# EasyEDA Pro project F446 V1.1.epro, board PCB2
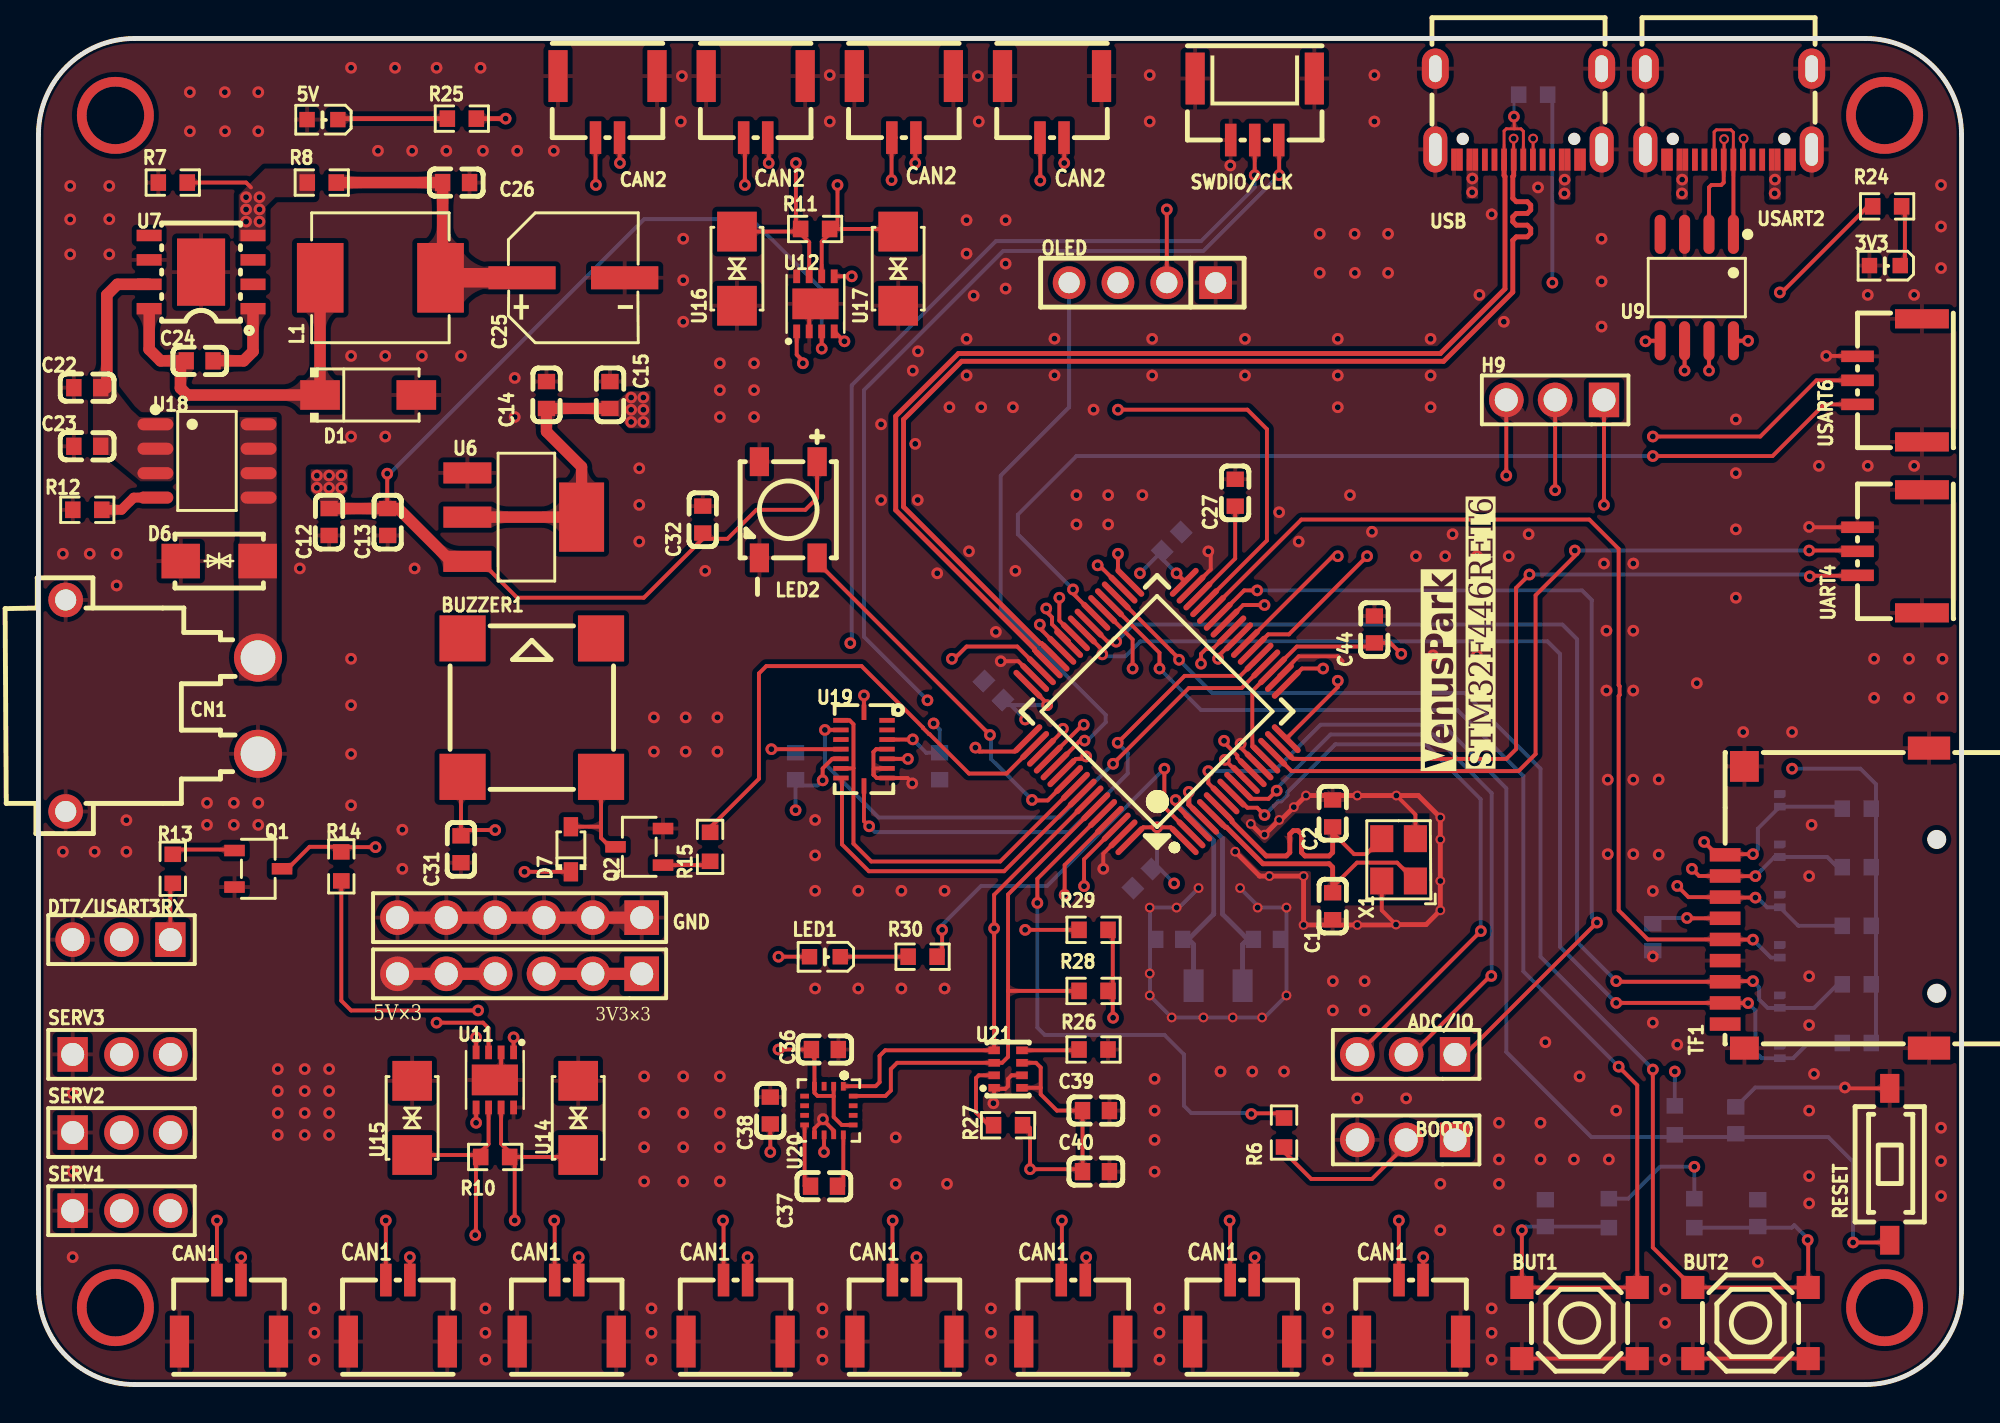
[diagram p1: board, top side]
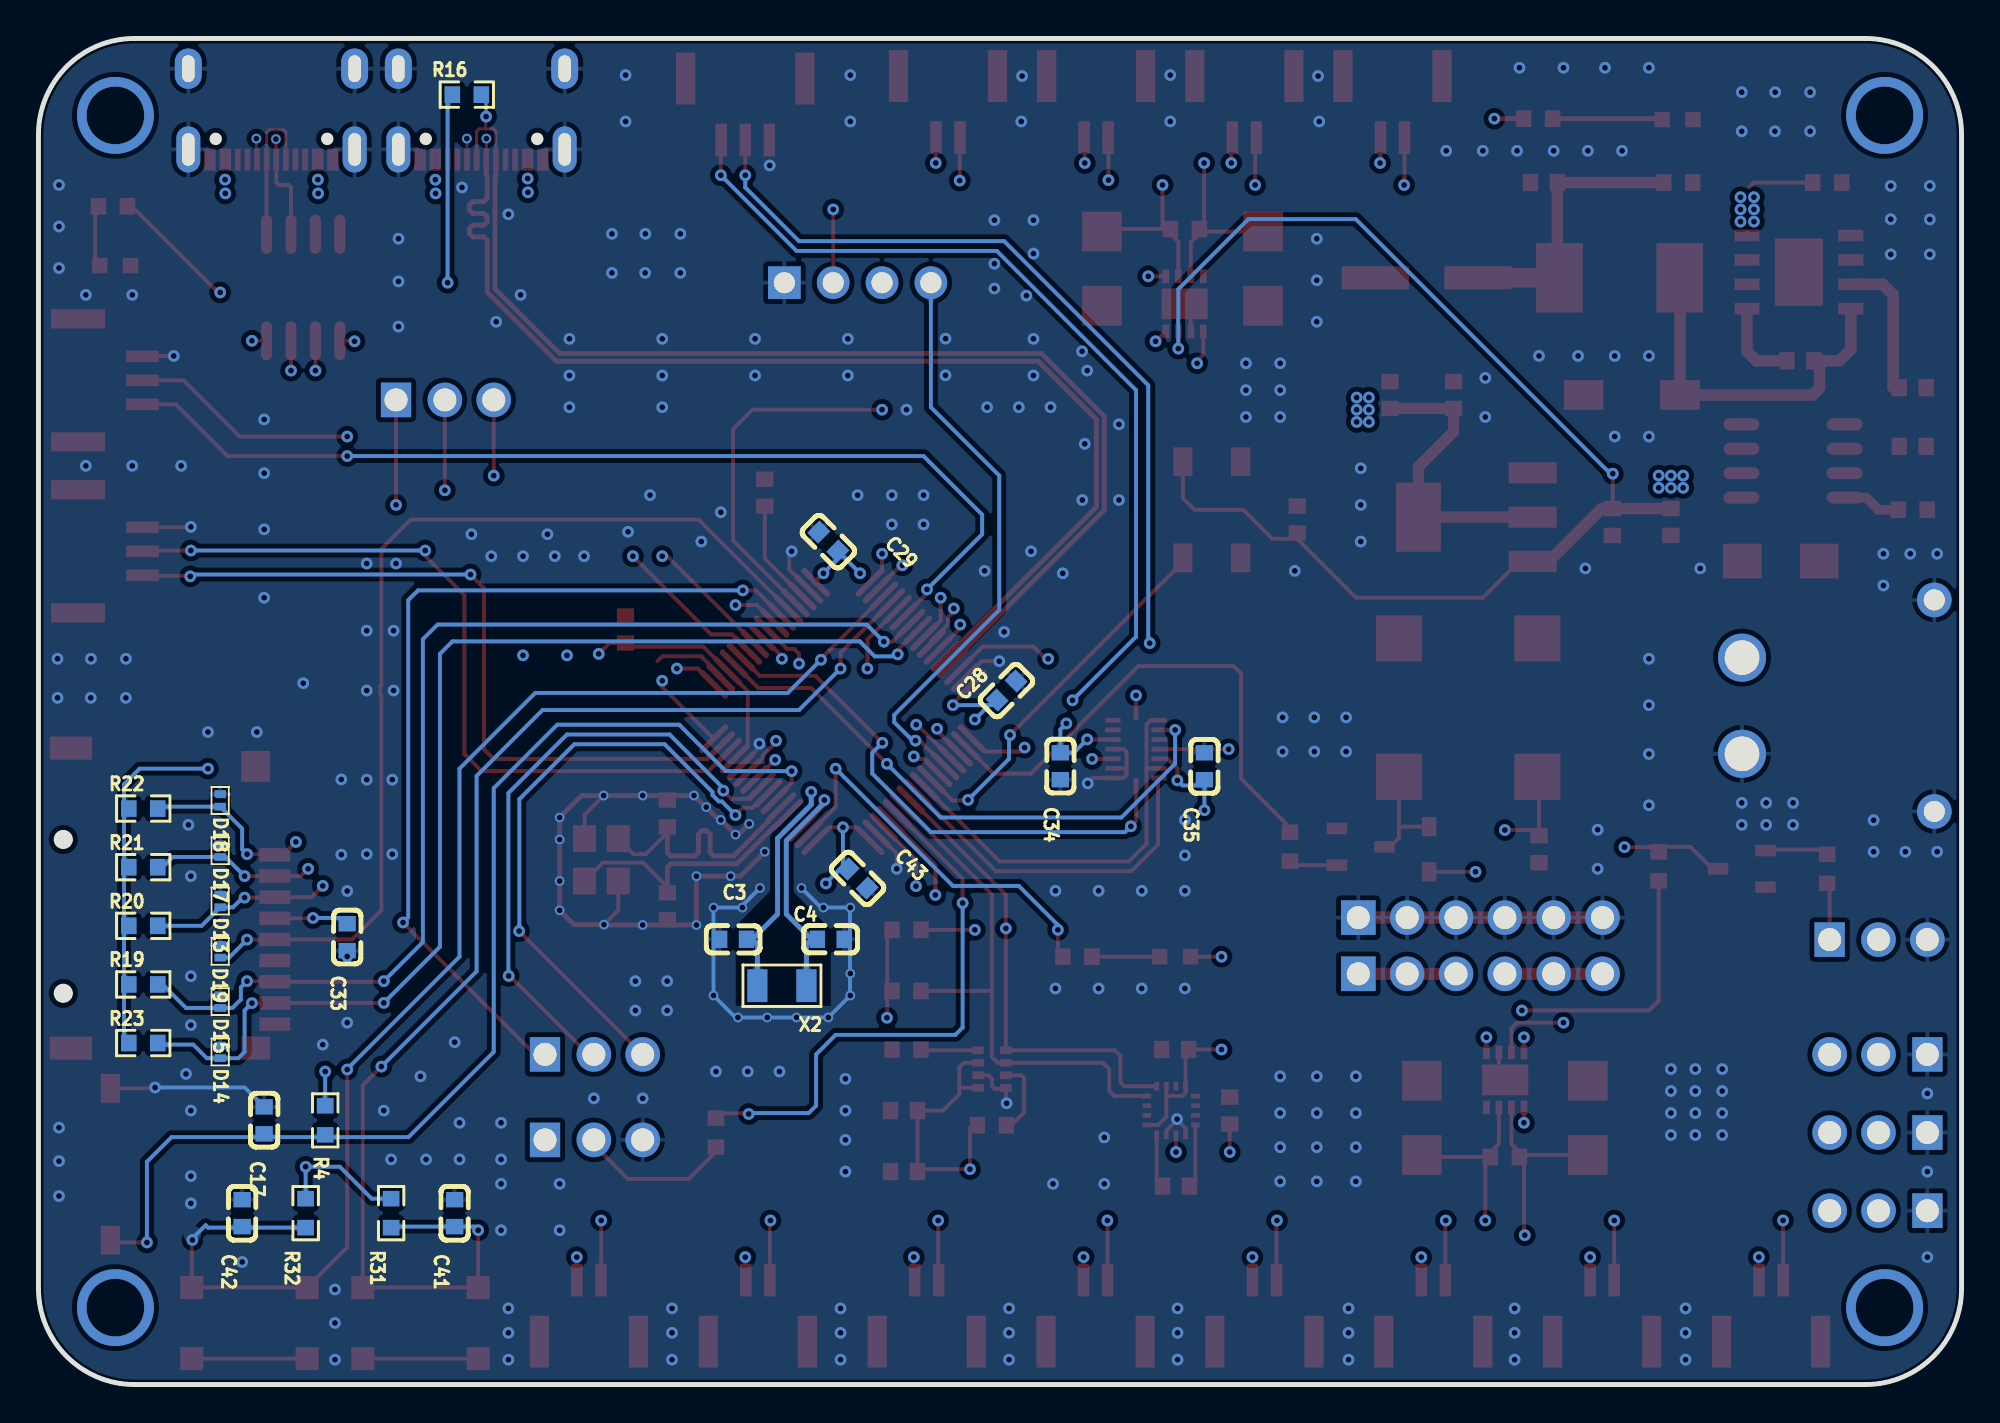
[diagram p2: board, bottom side, seen from below]

Outline 100 x 70 mm; copper layers: Top Layer, GND1, SIG, POW, GND2, Bottom Layer. Coordinates in mm from the lower left corner of the outline.
Outline path: 0,65 0,5 arc(1.46,1.46) 5,0 95,0 arc(98.54,1.46) 100,5 100,65 arc(98.54,68.54) 95,70 5,70 arc(1.46,68.54) 0,65
Stack: Top Layer 0.035mm 外层铜厚1oz / Dielectric1 0.2104mm 7628 RC49% 8.6mil / GND1 0.035mm 内层铜厚 / Dielectric2 0.4mm 0.4mm H/HOZ No copper / SIG 0.035mm 内层铜厚 / Dielectric3 0.2028mm 7628 RC49% 8.6mil / POW 0.035mm 内层铜厚 / Dielectric4 0.4mm 0.4mm H/HOZ No copper / GND2 0.035mm 内层铜厚 / Dielectric5 0.2104mm 7628 RC49% 8.6mil / Bottom Layer 0.035mm 外层铜厚1oz

## Design rules (mm)
net OSC_IN: osc
net OSC_OUT: osc
net OSC32OUT: osc32
net OSC32IN: osc32
net USB_DP: USB_FS
net USB_DM: USB_FS
net TTL_DP: USB_TTL
net TTL_DM: USB_TTL
template: 自定义配置
spacing copperThickness1oz (default): track to track 0.102, other pairs 0.152 to 0.3
spacing copperThickness2oz: track to track 0.203, other pairs 0.152 to 0.3
track width copperThickness1oz (default): min 0.127, default 0.203, max 2.54
track width copperThickness2oz: min 0.203, default 0.254, max 2.54
differential pair differentialPair (default): width min 0.127, default 0.254, max 2.54; gap min 0.152, default 0.152
via viaSize (default): diameter min 0.406, default 0.61, max 10; hole min 0.305, default 0.305, max 6.299

## Placement (name value [footprint] x y rotation side)
3V3  -  [LED0603-R-RD_WHITE]  96.01 58.19 180 top
3V3×3  -  [HDR-TH_6P-P2.54-V-M-1]  25.02 21.36 180 top
5V  -  [LED0603-R-RD_WHITE]  14.77 65.78 180 top
ADC/IO  -  [HDR-TH_3P-P2.54-V-M-1]  71.12 17.17 180 top
BOOT0
  -  [HDR-TH_3P-P2.54-V-M-1]  71.12 12.72 180 top
BUT1  -  [KEY-SMD_4P-L5.1-W5.1-P3.70-LS6.5]  80.14 3.2 0 top
BUT2  -  [KEY-SMD_4P-L5.1-W5.1-P3.70-LS6.5]  89.03 3.2 0 top
BUZZER1  2.7kHz  [BUZ-SMD_4P-L8.5-W8.5-P8.50-BR]  25.65 35.2 0 top
C1  20pF  [C0603]  67.3 24.87 270 top
C2  20pF  [C0603]  67.3 29.7 270 top
C3  20pF  [C0603]  63.88 23.15 0 bottom
C4  20pF  [C0603]  58.8 23.15 180 bottom
C12  10uF  [C0603]  15.11 44.85 90 top
C13  100nF  [C0603]  18.16 44.85 90 top
C14  10uF  [C0603]  26.42 51.46 270 top
C15  100nF  [C0603]  29.72 51.46 270 top
C17  1uF  [C0603]  88.26 13.74 270 bottom
C22  100nF  [C0603]  2.54 51.84 0 top
C23  10uF  [C0603]  2.54 48.79 0 top
C24  100nF  [C0603]  8.38 53.24 180 top
C25  220uF  [CAP-SMD_BD6.3-L6.6-W6.6-LS7.2-FD]  27.81 57.55 0 top
C26  100nF  [C0603]  21.72 62.51 180 top
C27  2.2uF  [C0603]  62.23 46.38 90 top
C28  100nF  [C0603]  49.66 36.09 135 bottom
C29  100nF  [C0603]  58.93 43.84 45 bottom
C31  100nF  [C0603]  21.97 27.84 90 top
C32  100nF  [C0603]  34.54 44.98 90 top
C33  100nF  [C0603]  83.95 23.26 270 bottom
C34  100nF  [C0603]  46.86 32.15 270 bottom
C35  100nF  [C0603]  39.37 32.15 90 bottom
C36  100nF  [C0603]  40.89 17.42 0 top
C37  220nF  [C0603]  40.85 10.31 0 top
C38  10uF  [C0603]  38.05 14.25 270 top
C39  100nF  [C0603]  54.99 14.25 0 top
C40  100nF  [C0603]  54.99 11.07 0 top
C41  1uF  [C0603]  78.36 8.91 90 bottom
C42  1uF  [C0603]  89.41 8.91 90 bottom
C43  100nF  [C0603]  57.4 26.31 225 bottom
C44  100nF  [C0603]  69.47 39.27 90 top
CAN1  -  [CONN-SMD_A1257WR-S-2P]  9.91 3.83 0 top
CAN2  -  [CONN-SMD_A1257WR-S-2P]  29.59 66.44 180 top
CN1  XT30PW-M  [CONN-TH_XT30PW-M]  6.42 35.3 270 top
CN7  A1257WR-S-2P  [CONN-SMD_A1257WR-S-2P]  18.69 3.83 0 top
CN8  A1257WR-S-2P  [CONN-SMD_A1257WR-S-2P]  27.47 3.83 0 top
CN9  A1257WR-S-2P  [CONN-SMD_A1257WR-S-2P]  36.25 3.83 0 top
CN10  A1257WR-S-2P  [CONN-SMD_A1257WR-S-2P]  45.03 3.83 0 top
CN11  A1257WR-S-2P  [CONN-SMD_A1257WR-S-2P]  53.81 3.83 0 top
CN12  A1257WR-S-2P  [CONN-SMD_A1257WR-S-2P]  62.59 3.83 0 top
CN13  A1257WR-S-2P  [CONN-SMD_A1257WR-S-2P]  71.37 3.83 0 top
CN15  A1257WR-S-2P  [CONN-SMD_A1257WR-S-2P]  37.3 66.44 180 top
CN16  A1257WR-S-2P  [CONN-SMD_A1257WR-S-2P]  45 66.44 180 top
CN17  A1257WR-S-2P  [CONN-SMD_A1257WR-S-2P]  52.71 66.44 180 top
D1  SS54  [SMA_L4.4-W2.8-LS5.4-R-RD]  17.14 51.46 0 top
D6  SMAJ28CA  [SMA_L4.3-W2.5-LS5.0-BI]  9.4 42.82 0 top
D7  IN4148WS  [SOD-323_L1.8-W1.3-LS2.5-RD]  27.69 27.84 90 top
D13  AZ5725-01F  [DFN-2L_L1.0-W0.6-P0.65-BI]  90.55 25.14 270 bottom
D14  AZ5725-01F  [DFN-2L_L1.0-W0.6-P0.65-BI]  90.55 17.3 270 bottom
D15  AZ5725-01F  [DFN-2L_L1.0-W0.6-P0.65-BI]  90.55 19.91 270 bottom
D17  AZ5725-01F  [DFN-2L_L1.0-W0.6-P0.65-BI]  90.55 27.76 270 bottom
D18  AZ5725-01F  [DFN-2L_L1.0-W0.6-P0.65-BI]  90.55 30.38 270 bottom
D19  AZ5725-01F  [DFN-2L_L1.0-W0.6-P0.65-BI]  90.55 22.53 270 bottom
DT7/USART3RX  -  [HDR-TH_3P-P2.54-V-M-1]  4.32 23.14 180 top
GND  -  [HDR-TH_6P-P2.54-V-M-1]  25.02 24.28 180 top
H9  2.54-1*3P针  [HDR-TH_3P-P2.54-V-M-1]  78.87 51.2 180 top
L1  15uH  [IND-SMD_L7.0-W6.6_FXL0630]  17.78 57.55 180 top
LED1  KT-0805G  [LED0603-R-RD_WHITE]  40.89 22.25 180 top
LED2  XL-5050RGBC-WS2812B  [LED-SMD_4P-L5.0-W5.0-BL_XL-5050RGBC]  38.99 45.49 180 top
OLED  -  [HDR-TH_4P-P2.54-V-F]  57.4 57.3 180 top
Q1  S8050  [SOT-23-3_L2.9-W1.6-P1.90-LS2.8-BR]  11.43 26.82 180 top
Q2  S8050  [SOT-23-3_L2.9-W1.6-P1.90-LS2.8-BR]  31.24 27.96 0 top
R4  10kΩ  [R0603]  85.09 13.74 90 bottom
R6  10kΩ  [R0603]  64.77 13.1 90 top
R7  100K  [R0603]  6.98 62.51 180 top
R8  10kΩ  [R0603]  14.73 62.51 180 top
R10  120Ω  [R0603]  23.75 11.83 0 top
R11  120Ω  [R0603]  40.39 60.09 180 top
R12  4.7kΩ  [R0603]  2.54 45.49 180 top
R13  4.7kΩ  [R0603]  6.98 26.82 90 top
R14  4.7kΩ  [R0603]  15.75 26.95 270 top
R15  1kΩ  [R0603]  34.93 27.96 270 top
R16  1.5kΩ  [R0603]  77.72 67.08 0 bottom
R19  10kΩ  [R0603]  94.55 20.81 180 bottom
R20  10kΩ  [R0603]  94.55 23.86 180 bottom
R21  10kΩ  [R0603]  94.55 26.9 180 bottom
R22  10kΩ  [R0603]  94.55 29.95 180 bottom
R23  10kΩ  [R0603]  94.55 17.76 180 bottom
R24  1kΩ  [R0603]  96.13 61.27 0 top
R25  4.7kΩ  [R0603]  22.02 65.83 180 top
R26  10kΩ  [R0603]  54.86 17.42 0 top
R27  10kΩ  [R0603]  50.42 13.48 180 top
R28  4.7kΩ  [R0603]  54.86 20.47 0 top
R29  4.7kΩ  [R0603]  54.86 23.64 0 top
R30  1kΩ  [R0603]  45.97 22.25 180 top
R31  10kΩ  [R0603]  81.66 8.91 90 bottom
R32  10kΩ  [R0603]  86.11 8.91 90 bottom
RESET  -  [SW-SMD_L6.0-W3.6-LS8.0]  96.27 11.45 90 top
SERV1  -  [HDR-TH_3P-P2.54-V-M-1]  4.32 9.04 0 top
SERV2  -  [HDR-TH_3P-P2.54-V-M-1]  4.32 13.1 0 top
SERV3  -  [HDR-TH_3P-P2.54-V-M-1]  4.32 17.17 0 top
STM32F446RET6  -  [LQFP-64_L10.0-W10.0-P0.50-LS12.0-BL]  58.17 35 45 top
SWDIO/CLK  -  [CONN-SMD_A1257WR-S-3P]  63.25 66.32 180 top
TF1  TF-012  [TF-SMD_TF-012]  93.01 25.3 90 top
U6  AMS1117-3.3  [SOT-223-3_L6.5-W3.4-P2.30-LS7.0-BR]  25.27 45.11 180 top
U7  TPS5430DDAR  [ESOP-8_L4.9-W3.9-P1.27-LS6.0-TL-EP]  8.46 57.85 180 top
U9  CH340N  [SOP-8_L5.0-W4.0-P1.27-LS6.0-BL]  86.23 57.05 180 top
U11  TJA1044GTK/3Z  [HVSON-8_L3.0-W3.0-P0.65-BL-EP]  23.73 15.84 180 top
U12  TJA1044GTK/3Z  [HVSON-8_L3.0-W3.0-P0.65-BL-EP]  40.4 56.2 0 top
U14  SMAJ10CA  [DO-214AC_L4.3-W2.7-LS5.0-BI]  28.07 13.87 270 top
U15  SMAJ10CA  [DO-214AC_L4.3-W2.7-LS5.0-BI]  19.43 13.87 270 top
U16  SMAJ10CA  [DO-214AC_L4.3-W2.7-LS5.0-BI]  36.32 58.03 90 top
U17  SMAJ10CA  [DO-214AC_L4.3-W2.7-LS5.0-BI]  44.7 58.03 90 top
U18  AO4441(UMW)  [SOP-8_L4.9-W3.9-P1.27-LS6.0-BL]  8.76 48.03 270 top
U19  BMI088  [LGA-16_L4.5-W3.0-P0.50-BL]  42.93 33.04 180 top
U20  QMC5883L  [LGA-16_L3.0-W3.0-P0.50-BL_SQ]  41.1 14.25 180 top
U21  BMP280  [LGA-8_L2.5-W2.0-P0.65_AMP6127]  50.42 16.41 180 top
UART4  -  [CONN-SMD_A1257WV-S-3P]  96.27 43.33 90 top
USART2  -  [USB-SMD_TYPE-C16PIN]  87.88 66.06 180 top
USART6  -  [CONN-SMD_A1257WV-S-3P]  96.27 52.22 90 top
USB  -  [USB-SMD_TYPE-C16PIN]  76.96 66.06 180 top
X1  12MHz  [OSC-SMD_4P-L3.2-W2.5-BL]  70.73 27.29 90 top
X2  32.768kHz  [OSC-SMD_L3.2-W1.5]  61.34 20.74 0 bottom

## Footprints (pads in the part's own frame, mm; a bottom-side part is the same pattern mirrored in y, then rotated)
BUZ-SMD_4P-L8.5-W8.5-P8.50-BR
  rect 2.4x2.4 smd: 1(-3.6,-3.6) 2(3.6,-3.6) 3(3.599,3.599) 4(-3.6,3.6)
C0603
  rect 0.8x0.9 smd: 1(-0.7,0) 2(0.7,0)
CAP-SMD_BD6.3-L6.6-W6.6-LS7.2-FD
  rect 3.5x1.2 smd: 1(-2.67,0) 2(2.67,0)
CONN-SMD_A1257WR-S-2P
  rect 0.6x1.7 smd: 1(0.625,1.6) 2(-0.625,1.6)
  rect 1x2.7 smd: 3(2.575,-1.6) 4(-2.575,-1.6)
CONN-SMD_A1257WR-S-3P
  rect 0.6x1.7 smd: 1(1.25,1.6) 2(0,1.6) 3(-1.25,1.6)
  rect 1x2.7 smd: 4(3.1,-1.6) 5(-3.1,-1.6)
CONN-SMD_A1257WV-S-3P
  rect 0.6x1.7 smd: 1(1.25,1.675) 2(0,1.675) 3(-1.25,1.675)
  rect 1x2.8 smd: 4(3.2,-1.675) 5(-3.2,-1.675)
CONN-TH_XT30PW-M
  round 2.5 hole 1.8: 1(-2.5,5) 2(2.5,5)
  round 1.8 hole 1.1: 3(5.5,-5) 4(-5.5,-5)
DFN-2L_L1.0-W0.6-P0.65-BI
  custom 0x0 smd: 1(-0.325,0)
  rect 0.4x0.6 smd: 2(0.325,0)
DO-214AC_L4.3-W2.7-LS5.0-BI
  rect 2.07x2.06 smd: 1(-1.929,0) 2(1.929,0)
ESOP-8_L4.9-W3.9-P1.27-LS6.0-TL-EP
  rect 1.3x0.6 smd: 1(-2.7,1.905) 2(-2.7,0.635) 3(-2.7,-0.635) 4(-2.7,-1.905) 5(2.7,-1.905) 6(2.7,-0.635) 7(2.7,0.635) 8(2.7,1.905)
  rect 2.5x3.5 smd: 9(0,0)
HDR-TH_3P-P2.54-V-M-1
  rect 1.575x1.8 hole 1.2: 1(-2.54,0)
  round 1.8 hole 1.2: 2(0,0) 3(2.54,0)
HDR-TH_4P-P2.54-V-F
  rect 1.7x1.7 hole 1.1: 1(-3.81,0)
  round 1.7 hole 1.1: 2(-1.27,0) 3(1.27,0) 4(3.81,0)
HDR-TH_6P-P2.54-V-M-1
  rect 1.8x1.8 hole 1.2: 1(-6.35,0)
  round 1.8 hole 1.2: 2(-3.81,0) 3(-1.27,0) 4(1.27,0) 5(3.81,0) 6(6.35,0)
HVSON-8_L3.0-W3.0-P0.65-BL-EP
  rect 0.355x0.711 smd: 1(-0.975,-1.433) 2(-0.325,-1.433) 3(0.325,-1.433) 4(0.975,-1.433) 5(0.975,1.433) 6(0.325,1.433) 7(-0.325,1.433) 8(-0.975,1.433)
  rect 2.4x1.6 smd: 9(0,0)
IND-SMD_L7.0-W6.6_FXL0630
  rect 2.424x3.62 smd: 1(3.128,0) 2(-3.128,0)
KEY-SMD_4P-L5.1-W5.1-P3.70-LS6.5
  rect 1.2x1.2 smd: 1(-3,1.85) 2(3,1.85) 3(-3,-1.85) 4(3,-1.85)
LED0603-R-RD_WHITE
  rect 0.8x0.8 smd: 1(0.8,0) 2(-0.8,0)
LED-SMD_4P-L5.0-W5.0-BL_XL-5050RGBC
  rect 1x1.5 smd: 1(-1.5,-2.5) 2(1.5,-2.5) 3(1.5,2.5) 4(-1.5,2.5)
LGA-8_L2.5-W2.0-P0.65_AMP6127
  rect 0.6x0.4 smd: 1(0.725,0.975) 2(0.725,0.325) 3(0.725,-0.325) 4(0.725,-0.975) 5(-0.725,-0.975) 6(-0.725,-0.325) 7(-0.725,0.325) 8(-0.725,0.975)
LGA-16_L3.0-W3.0-P0.50-BL_SQ
  rect 0.25x0.45 smd: 1(-0.75,-1.263) 2(-0.25,-1.263) 3(0.25,-1.263) 4(0.75,-1.263) 9(0.75,1.263) 10(0.25,1.263) 11(-0.25,1.263) 12(-0.75,1.263)
  rect 0.45x0.25 smd: 5(1.263,-0.75) 6(1.263,-0.25) 7(1.263,0.25) 8(1.263,0.75) 13(-1.263,0.75) 14(-1.263,0.25) 15(-1.263,-0.25) 16(-1.263,-0.75)
LGA-16_L4.5-W3.0-P0.50-BL
  rect 0.8x0.25 smd: 1(-1.2,-1.498) 2(-1.2,-0.998) 3(-1.2,-0.498) 4(-1.2,0.002) 5(-1.2,0.502) 6(-1.2,1.002) 7(-1.2,1.502) 9(1.2,1.502) 10(1.2,1.002) 11(1.2,0.502) 12(1.2,0.002) 13(1.2,-0.498) 14(1.2,-0.998) 15(1.2,-1.498)
  rect 0.25x0.8 smd: 8(0,1.915) 16(0,-1.915)
LQFP-64_L10.0-W10.0-P0.50-LS12.0-BL
  oval 0.3x2 smd: 1(-3.75,-5.75) 2(-3.25,-5.75) 3(-2.75,-5.75) 4(-2.25,-5.75) 5(-1.75,-5.75) 6(-1.25,-5.75) 7(-0.75,-5.75) 8(-0.25,-5.75) 9(0.25,-5.75) 10(0.75,-5.75) 11(1.25,-5.75) 12(1.75,-5.75) 13(2.25,-5.75) 14(2.75,-5.75) 15(3.25,-5.75) 16(3.75,-5.75) 33(3.75,5.75) 34(3.25,5.75) 35(2.75,5.75) 36(2.25,5.75) 37(1.75,5.75) 38(1.25,5.75) 39(0.75,5.75) 40(0.25,5.75) 41(-0.25,5.75) 42(-0.75,5.75) 43(-1.25,5.75) 44(-1.75,5.75) 45(-2.25,5.75) 46(-2.75,5.75) 47(-3.25,5.75) 48(-3.75,5.75)
  oval 2x0.3 smd: 17(5.75,-3.75) 18(5.75,-3.25) 19(5.75,-2.75) 20(5.75,-2.25) 21(5.75,-1.75) 22(5.75,-1.25) 23(5.75,-0.75) 24(5.75,-0.25) 25(5.75,0.25) 26(5.75,0.75) 27(5.75,1.25) 28(5.75,1.75) 29(5.75,2.25) 30(5.75,2.75) 31(5.75,3.25) 32(5.75,3.75) 49(-5.75,3.75) 50(-5.75,3.25) 51(-5.75,2.75) 52(-5.75,2.25) 53(-5.75,1.75) 54(-5.75,1.25) 55(-5.75,0.75) 56(-5.75,0.25) 57(-5.75,-0.25) 58(-5.75,-0.75) 59(-5.75,-1.25) 60(-5.75,-1.75) 61(-5.75,-2.25) 62(-5.75,-2.75) 63(-5.75,-3.25) 64(-5.75,-3.75)
OSC-SMD_4P-L3.2-W2.5-BL
  rect 1.4x1.2 smd: 1(-1.1,-0.875) 2(1.1,-0.875) 3(1.1,0.875) 4(-1.1,0.875)
OSC-SMD_L3.2-W1.5
  rect 1.05x1.7 smd: 1(-1.275,0) 2(1.275,0)
R0603
  rect 0.806x0.864 smd: 1(-0.753,0) 2(0.753,0)
SMA_L4.3-W2.5-LS5.0-BI
  rect 2x1.8 smd: 1(-2,0) 2(2,0)
SMA_L4.4-W2.8-LS5.4-R-RD
  rect 2.062x1.539 smd: 1(2.503,0) 2(-2.503,0)
SOD-323_L1.8-W1.3-LS2.5-RD
  rect 1x0.75 smd: 1(-1.173,0) 2(1.173,0)
SOP-8_L4.9-W3.9-P1.27-LS6.0-BL
  oval 0.63x1.865 smd: 1(-1.905,-2.683) 2(-0.635,-2.683) 3(0.635,-2.683) 4(1.905,-2.683) 5(1.905,2.683) 6(0.635,2.683) 7(-0.635,2.683) 8(-1.905,2.683)
SOP-8_L5.0-W4.0-P1.27-LS6.0-BL
  oval 0.574x2.035 smd: 1(-1.905,-2.768) 2(-0.635,-2.768) 3(0.635,-2.768) 4(1.905,-2.768) 5(1.905,2.768) 6(0.635,2.768) 7(-0.635,2.768) 8(-1.905,2.768)
SOT-23-3_L2.9-W1.6-P1.90-LS2.8-BR
  rect 1.07x0.6 smd: 1(1.235,-0.95) 2(1.235,0.95) 3(-1.235,0)
SOT-223-3_L6.5-W3.4-P2.30-LS7.0-BR
  rect 2.5x1.1 smd: 1(2.97,-2.3) 2(2.97,0) 3(2.97,2.3)
  rect 2.34x3.6 smd: 4(-2.97,0)
SW-SMD_L6.0-W3.6-LS8.0
  rect 1.5x1 smd: 1(-3.95,0) 2(3.95,0)
TF-SMD_TF-012
  rect 0.7x1.6 smd: 1(2.25,5.3) 2(1.15,5.3) 3(0.05,5.3) 4(-1.05,5.3) 5(-2.15,5.3) 6(-3.25,5.3) 7(-4.35,5.3) 8(-5.45,5.3) CD(-6.55,5.3)
  rect 1.2x1.5 smd: 10(-7.8,4.3)
  rect 1.2x2.2 smd: 11(-7.8,-5.3) 12(7.8,-5.3)
  rect 1.6x1.5 smd: 13(6.85,4.3)
USB-SMD_TYPE-C16PIN
  oval 1.25x2.4 hole 0.65x1.7: 17(-4.325,1.835) 18(4.325,1.835)
  oval 1.4x2.1 hole 0.65x1.4: 19(-4.325,-2.365) 20(4.325,-2.365)
  rect 0.3x1.15 smd: A1(-3.35,2.365) A4(-2.55,2.365) A5(-1.25,2.365) A6(-0.25,2.365) A7(0.25,2.365) A8(1.25,2.365) A9(2.55,2.365) A12(3.35,2.365) B1(3.05,2.365) B4(2.25,2.365) B5(1.75,2.365) B6(0.75,2.365) B7(-0.75,2.365) B8(-1.75,2.365) B9(-2.25,2.365) B12(-3.05,2.365)

## Nets
+5V: 3V3×3.4 3V3×3.5 3V3×3.6 C12.2 C13.2 C32.1 DT7/USART3RX.2 LED2.1 OLED.2 R7.1 R8.2 R25.1 SERV1.2 SERV2.2 SERV3.2 U6.3 U7.4 U11.3 U12.3 USART2.A4 USART2.A9 USART2.B4 USART2.B9 USB.A4 USB.A9 USB.B4 USB.B9
GND: 3V3.1 5V.1 BOOT0
.3 BUT1.3 BUT1.4 BUT2.3 BUT2.4 C1.2 C2.1 C3.2 C4.2 C12.1 C13.1 C14.1 C15.1 C17.1 C22.1 C23.1 C25.2 C26.1 C27.2 C28.2 C29.2 C31.1 C32.2 C33.2 C34.2 C35.2 C36.2 C38.1 C39.2 C40.2 C41.2 C42.2 C43.2 C44.2 CAN1.3 CAN1.4 CAN2.3 CAN2.4 CN1.2 CN1.3 CN1.4 CN7.3 CN7.4 CN8.3 CN8.4 CN9.3 CN9.4 CN10.3 CN10.4 CN11.3 CN11.4 CN12.3 CN12.4 CN13.3 CN13.4 CN15.3 CN15.4 CN16.3 CN16.4 CN17.3 CN17.4 D1.1 D6.1 D13.1 D14.1 D15.1 D17.1 D18.1 D19.1 DT7/USART3RX.3 GND.1 GND.2 GND.3 GND.4 GND.5 GND.6 LED2.2 LED2.3 OLED.1 Q1.2 Q2.2 R7.2 R12.2 R26.2 RESET.2 SERV1.1 SERV2.1 SERV3.1 STM32F446RET6.12 STM32F446RET6.18 STM32F446RET6.31 STM32F446RET6.47 STM32F446RET6.63 SWDIO/CLK.1 SWDIO/CLK.4 SWDIO/CLK.5 TF1.6 TF1.10 TF1.11 TF1.12 TF1.13 U6.1 U7.6 U7.9 U9.3 U11.2 U11.8 U11.9 U12.2 U12.8 U12.9 U14.1 U15.1 U16.1 U17.1 U19.4 U19.6 U19.7 U20.9 U20.11 U21.1 U21.7 UART4.1 UART4.4 UART4.5 USART2.17 USART2.18 USART2.19 USART2.20 USART2.A1 USART2.A12 USART2.B1 USART2.B12 USART6.1 USART6.4 USART6.5 USB.17 USB.18 USB.19 USB.20 USB.A1 USB.A12 USB.B1 USB.B12 X1.2 X1.4
VCC3V3: 3V3×3.1 3V3×3.2 3V3×3.3 BOOT0
.1 BUZZER1.1 C14.2 C15.2 C28.1 C29.1 C31.2 C33.1 C34.1 C35.1 C36.1 C39.1 C40.1 C43.1 C44.1 D7.1 LED1.1 R4.2 R14.2 R16.2 R19.1 R20.1 R21.1 R22.1 R23.1 R24.1 R27.1 R28.2 R29.2 R31.2 R32.2 STM32F446RET6.1 STM32F446RET6.13 STM32F446RET6.19 STM32F446RET6.32 STM32F446RET6.48 STM32F446RET6.64 TF1.4 U6.2 U6.4 U9.5 U9.8 U11.5 U12.5 U19.3 U19.11 U20.2 U20.4 U20.13 U21.6 U21.8
VCC24V: C22.2 C23.2 U7.7 U18.1 U18.2 U18.3
ACCEL_CS: STM32F446RET6.20 U19.14
ACCEL_INT: STM32F446RET6.11 U19.16
ADC_IN1: ADC/IO.1 STM32F446RET6.27
ADC_IN2: ADC/IO.2 STM32F446RET6.9
ADC_IN3: ADC/IO.3 STM32F446RET6.8
BMI088_MISO: STM32F446RET6.56 U19.10 U19.15
BMI088_MOSI: STM32F446RET6.57 U19.9
BMI088_SCK: STM32F446RET6.21 U19.8
BOOT0: R6.2 STM32F446RET6.60
BUTTON1: BUT1.1 BUT1.2 C41.1 R31.1 STM32F446RET6.36
BUTTON2: BUT2.1 BUT2.2 C42.1 R32.1 STM32F446RET6.35
BUZZER: R15.1 STM32F446RET6.50
CAN1_H: CAN1.2 CN7.2 CN8.2 CN9.2 CN10.2 CN11.2 CN12.2 CN13.2 R10.2 U11.7 U14.2
CAN1_L: CAN1.1 CN7.1 CN8.1 CN9.1 CN10.1 CN11.1 CN12.1 CN13.1 R10.1 U11.6 U15.2
CAN1_RX: STM32F446RET6.61 U11.4
CAN1_TX: STM32F446RET6.62 U11.1
CAN2_H: CAN2.2 CN15.2 CN16.2 CN17.2 R11.2 U12.7 U16.2
CAN2_L: CAN2.1 CN15.1 CN16.1 CN17.1 R11.1 U12.6 U17.2
CAN2_RX: STM32F446RET6.33 U12.4
CAN2_TX: STM32F446RET6.34 U12.1
GYRO_CS: STM32F446RET6.24 U19.5
GYRO_INT: STM32F446RET6.10 U19.12
IMU_SCL: R29.1 STM32F446RET6.58 U20.1 U21.4
IMU_SDA: R28.1 STM32F446RET6.59 U20.16 U21.3
LED1: R30.1 STM32F446RET6.2
NRST: C17.2 R4.1 RESET.1 STM32F446RET6.7
OLED_SCL: OLED.3 STM32F446RET6.29
OLED_SDA: OLED.4 STM32F446RET6.53
OSC32IN: C4.1 STM32F446RET6.3 X2.1
OSC32OUT: C3.1 STM32F446RET6.4 X2.2
OSC_IN: C1.1 STM32F446RET6.5 X1.1
OSC_OUT: C2.2 STM32F446RET6.6 X1.3
POWER: CN1.1 D6.2 U18.5 U18.6 U18.7 U18.8
SDIO_CK: D19.2 STM32F446RET6.28 TF1.5
SDIO_CMD: D13.2 R20.2 STM32F446RET6.54 TF1.3
SDIO_D0: D15.2 R19.2 STM32F446RET6.39 TF1.7
SDIO_D1: D14.2 R23.2 STM32F446RET6.40 TF1.8
SDIO_D2: D18.2 R22.2 STM32F446RET6.51 TF1.1
SDIO_D3: D17.2 R21.2 STM32F446RET6.52 TF1.2
SERVO1: SERV1.3 STM32F446RET6.43
SERVO2: SERV2.3 STM32F446RET6.42
SERVO3: SERV3.3 STM32F446RET6.41
SWCLK: STM32F446RET6.49 SWDIO/CLK.3
SWDIO: STM32F446RET6.46 SWDIO/CLK.2
TIM3_CH1: H9.1 STM32F446RET6.22
TIM3_CH2: H9.2 STM32F446RET6.23
TIM3_CH3: H9.3 STM32F446RET6.26
TTL_DM: U9.2 USART2.A7 USART2.B7
TTL_DP: U9.1 USART2.A6 USART2.B6
UART4_RX: STM32F446RET6.15 UART4.3
UART4_TX: STM32F446RET6.14 UART4.2
USART2_RX: STM32F446RET6.17 U9.6
USART2_TX: STM32F446RET6.16 U9.7
USART3_RX: Q1.3 R14.1 STM32F446RET6.25
USART6_RX: STM32F446RET6.38 USART6.3
USART6_TX: STM32F446RET6.37 USART6.2
USB_DM: STM32F446RET6.44 USB.A7 USB.B7
USB_DP: R16.1 STM32F446RET6.45 USB.A6 USB.B6
WS2812: LED2.4 STM32F446RET6.55
$1N6813: BOOT0
.2 R6.1
$1N10170: C24.1 U7.1
$1N10572: C24.2 D1.2 L1.1 U7.8
$1N10581: C25.1 C26.2 L1.2 R8.1
$1N11994: C27.1 STM32F446RET6.30
$1N17339: R12.1 U18.4
$1N17600: DT7/USART3RX.1 R13.1
$1N17601: Q1.1 R13.2
$1N17854: BUZZER1.2 D7.2 Q2.3
$1N17986: Q2.1 R15.2
$1N19919: 3V3.2 R24.2
$1N19978: 5V.2 R25.2
$1N20666: C37.2 U20.12
$1N20667: C37.1 U20.8
$1N20697: C38.2 U20.10
$1N20825: R26.1 U21.5
$1N21033: R27.2 U21.2
$1N21210: LED1.2 R30.2

Pads without a net: BUZZER1 3 4; TF1 CD; U7 2 3 5; U9 4; U19 1 2 13; U20 3 5 6 7 14 15; USART2 A5 A8 B5 B8; USB A5 A8 B5 B8

## Via types
v1: diameter 4, hole 3, Top Layer to Bottom Layer, 4 vias
v2: diameter 0.61, hole 0.305, Top Layer to Bottom Layer, 477 vias
v3: diameter 0.508, hole 0.305, Top Layer to Bottom Layer, 34 vias

## Routing (per net, layer and track width the routed paths; a pad name or vN(x,y) marks a point on that pad's centre or on a via; arc(x,y) is an arc through that point)
+5V: length 84.1
  Top Layer w0.203: OLED.2 v2(58.67,61.11) ; U12.3 v2(40.73,53.87) ; 7.98,62.51 10.8,62.51 11.05,62.25 ; U11.3 23.41,18.53 23.11,18.82 v2(20.7,18.82) ; v2(18.14,47.37) 18.14,45.58 C13.2 ; U6.3 23,42.81 24.89,40.92 31.48,40.92 34.54,43.98 35.83,43.98 37.34,45.49 39.88,45.49 40.49,46.1 LED2.1
  Top Layer w0.254: 23.02,65.83 v2(24.29,65.83)
  Top Layer w0.6: U6.3 21.46,42.81 18.71,45.55 C13.2 C12.2
  Top Layer w0.635: 18.67,21.36 3V3×3.5 23.75,21.36
  Bottom Layer w0.203: v2(40.73,53.87) 40.73,56.96 37.08,60.6 31.5,60.6 18.26,47.37 v2(18.14,47.37)
  vias: v2(10.8,61.75) v2(10.8,61.11) v2(10.8,60.47) v2(11.49,61.75) v2(11.49,61.11) v2(11.49,60.47) v2(14.48,47.27) v2(14.48,46.63) v2(15.11,47.27) v2(15.11,46.63) v2(15.75,47.27) v2(15.75,46.63) v2(74.55,62) v2(74.56,62.72) v2(79.35,61.94) v2(79.36,62.66) v2(85.47,62.66) v2(85.46,61.94) v2(90.3,62.66) v2(90.28,61.94)
GND: length 121.1
  Top Layer w0.203: STM32F446RET6.18 64.53,36.87 65.53,37.87 67.56,37.87 67.82,37.61 ; STM32F446RET6.63 55.37,27.61 v2(55.37,26.82) ; X1.4 69.85,24.66 v3(70.59,23.92) ; U11.9 24.06,16.17 U11.2 ; 44.13,33.04 43.56,33.04 43.42,32.9 43.42,31.71 43.43,31.7 ; v2(62.51,33.33) 62.51,33.13 63.47,32.17 ; U20.9 40.35,13.32 40.79,13.77 ; 40.79,13.77 41.35,13.21 U20.11 ; 40.79,13.77 v2(40.79,13.8) ; 43.43,31.7 43.43,32.03 43.45,32.04 44.13,32.04 ; 43.43,31.7 43.59,31.54 45.19,31.54 45.44,31.29 45.44,31.27 v2(45.44,31.26) ; BUT1.3 BUT1.4 ; v3(70.61,30.63) 71.6,29.64 X1.2 ; 60.96,43.2 60.96,42.39 STM32F446RET6.31 ; v2(92.96,53.49) 94.57,53.49 94.59,53.47 ; v2(92.07,44.6) 92.09,44.58 94.59,44.58 ; BUT2.3 BUT2.4 ; v2(93.94,15.45) 93.98,15.4 RESET.2 ; 40.08,54.77 40.08,55.87 U12.9 ; STM32F446RET6.47 50.96,37.61 v2(50.04,37.61) ; v2(49.66,14.63) 49.69,14.67 U21.1 49.75,15.37 50.28,15.37 50.42,15.52 50.42,15.9 50.6,16.08 U21.7
  Top Layer w0.254: v3(63.04,29.16) 63.6,28.6 v3(63.75,28.6) v3(64.52,29.36) 64.61,29.36 v3(65.28,30.03) 65.31,30.03 v3(65.91,30.63) v3(68.58,30.63) v3(70.61,30.63) 71.75,30.63 v3(72.9,29.49) v3(72.9,28.34) v3(72.9,26.19) v3(72.9,24.66) 72.16,23.92 v3(70.59,23.92) 70.57,23.9 v3(68.58,23.9) v3(65.79,23.9) v3(65.79,26.44) v3(64.01,26.44) 63.5,26.44 v3(62.23,27.71)
  Top Layer w0.635: 18.67,24.28 GND.5 GND.3 GND.2 GND.1
  Bottom Layer w0.203: v3(62.48,25.82) 63.4,24.91 v3(63.4,24.8) v3(64.9,24.8) v3(64.9,20.23) 63.75,19.09 v3(63.63,19.09) v3(62.1,19.09) v3(60.58,19.09) v3(58.93,19.09) v3(57.78,20.23) 57.8,20.25 57.8,24.79 v3(57.78,24.8) v3(59.18,24.8) 59.31,24.8 v3(60.32,25.82) ; C17.1 89.27,15.45 v2(93.94,15.45)
  vias: v2(1.27,43.2) v2(1.27,27.71) v2(1.65,62.33) v2(1.65,60.59) v2(1.65,58.77) v2(1.78,15.14) v2(1.78,11.07) v2(1.78,6.63) v2(2.67,43.2) v2(2.92,27.71) v2(3.68,62.33) v2(3.68,60.6) v2(3.68,58.77) v2(4.06,43.2) v2(4.06,41.55) v2(4.57,29.35) v2(4.57,27.71) v2(7.87,67.21) v2(7.87,65.17) v2(8.76,30.25) v2(8.76,29.11) v2(9.69,67.21) v2(9.7,65.17) v2(10.16,30.25) v2(10.16,29.11) v2(11.43,67.21) v2(11.43,65.17) v2(11.43,30.25) v2(11.43,29.11) v2(12.45,16.41) v2(12.45,15.26) v2(12.45,14.12) v2(12.45,12.98) v2(13.59,42.44) v2(13.84,16.41) v2(13.84,15.26) v2(13.84,14.12) v2(13.84,12.98) v2(14.35,3.96) v2(14.35,2.69) v2(14.35,1.29) v2(15.11,16.41) v2(15.11,15.26) v2(15.11,14.12) v2(15.11,12.98) v2(16.26,68.48) v2(16.26,53.49) v2(16.26,49.3) v2(16.26,37.74) v2(16.26,35.33) v2(16.26,32.79) v2(16.26,30.12) v2(17.65,64.16) v2(18.03,53.49) v2(18.03,49.3) v2(18.54,68.48) v2(18.92,28.85) v2(18.92,26.82) v2(19.43,64.16) v2(19.56,42.44) v2(19.94,53.49) v2(20.7,68.48) v2(21.21,64.16) v2(21.97,53.49) v2(22.99,68.48) v2(23.11,64.16) v2(23.24,3.96) v2(23.24,2.69) v2(23.24,1.29) v2(24.77,52.35) v2(24.77,50.31) v2(24.89,64.16) v2(26.8,64.16) v2(31.24,47.65) v2(31.24,45.74) v2(31.24,43.84) v2(31.5,16.03) v2(31.5,14.12) v2(31.5,12.34) v2(31.5,10.56) v2(31.88,3.96) v2(31.88,2.69) v2(31.88,1.29) v2(32,34.69) v2(32,32.92) v2(33.4,65.68) v2(33.46,68.04) v2(33.53,59.59) v2(33.53,57.43) v2(33.53,55.27) v2(33.53,16.03) v2(33.53,14.12) v2(33.53,12.34) v2(33.53,10.56) v2(33.66,34.69) v2(33.66,32.92) v2(34.67,42.31) v2(35.31,34.69) v2(35.31,32.92) v2(35.43,53.11) v2(35.43,51.71) v2(35.43,50.31) v2(35.43,16.03) v2(35.43,14.12) v2(35.43,12.34) v2(35.43,10.56) v2(37.21,53.11) v2(37.21,51.71) v2(37.21,50.31) v2(40.39,29.36) v2(40.39,27.52) v2(40.39,25.68) v2(40.39,20.6) v2(40.77,3.96) v2(40.77,2.69) v2(40.77,1.29) v2(41.15,68.09) v2(41.15,65.68) v2(42.63,25.68) v2(42.63,20.6) v2(43.81,49.93) v2(43.81,46) v2(44.58,12.85) v2(44.58,10.44) v2(44.87,25.68) v2(44.87,20.6) v2(45.47,52.73) v2(45.59,48.92) v2(45.73,53.73) v2(45.72,46) v2(46.74,42.19) v2(47.12,25.68) v2(47.12,20.6) v2(47.24,10.44) v2(47.37,50.82) v2(48.26,60.55) v2(48.26,58.81) v2(48.26,54.38) v2(48.26,52.47) v2(48.39,43.33) v2(48.63,56.63) v2(48.85,68.04) v2(48.9,65.68) v2(49.02,50.82) v2(49.53,3.96) v2(49.53,2.69) v2(49.53,1.29) v2(49.78,39.14) v2(50.29,60.55) v2(50.29,58.29) v2(50.29,57) v2(50.67,50.82) v2(50.8,42.31) v2(52.83,54.39) v2(52.83,52.48) v2(53.97,46.25) v2(53.97,44.73) v2(54.86,50.7) v2(55.63,46.25) v2(55.63,44.73) v2(57.4,46.25) v2(57.78,68.09) v2(57.78,65.68) v2(57.91,54.38) v2(57.91,52.47) v2(58.04,15.9) v2(58.04,14.25) v2(58.04,12.72) v2(58.04,11.07) v2(58.29,3.96) v2(58.29,2.69) v2(58.29,1.29) v2(60.83,43.33) v2(61.47,16.28) v2(61.98,63.4) v2(62.74,54.38) v2(62.74,52.47) v2(63.12,16.28) v2(64.52,45.36) v2(64.77,16.28) v2(65.53,43.84) v2(66.62,59.84) v2(66.62,57.81) v2(67.06,3.96) v2(67.06,2.69) v2(67.06,1.29) v2(67.31,20.98) v2(67.31,19.45) v2(67.56,54.38) v2(67.56,52.47) v2(67.56,50.82) v2(68.2,46.25) v2(68.44,59.84) v2(68.45,57.81) v2(68.58,14.88) v2(68.96,20.98) v2(68.96,19.45) v2(69.34,44.35) v2(69.47,68.09) v2(69.47,65.68) v2(70.18,59.84) v2(70.18,57.81) v2(71.12,14.88) v2(71.63,43.08) v2(72.39,54.38) v2(72.39,52.47) v2(72.39,50.82) v2(72.52,37.92) v2(72.9,10.44) v2(72.9,8.02) v2(73.15,43.08) v2(73.53,44.22) v2(74.8,43.08) v2(74.8,37.92) v2(74.93,56.67) v2(75.56,60.86) v2(75.56,3.96) v2(75.56,2.69) v2(75.56,1.29) v2(75.95,13.61) v2(75.95,11.71) v2(75.95,10.44) v2(75.95,8.02) v2(76.2,55.27) v2(76.45,43.08) v2(77.49,44.22) v2(77.98,62.25) v2(78.1,13.61) v2(78.1,11.71) v2(78.36,17.8) v2(79.84,11.71) v2(80.14,16.03) v2(81.28,59.59) v2(81.28,57.37) v2(81.28,55.02) v2(81.41,42.69) v2(81.53,39.2) v2(81.53,36.09) v2(81.6,31.46) v2(81.6,27.58) v2(81.66,11.71) v2(82.04,14.25) v2(82.93,42.69) v2(82.93,39.2) v2(82.93,36.09) v2(82.93,31.46) v2(82.93,27.58) v2(83.95,25.67) v2(83.95,22.26) v2(83.95,18.82) v2(84.25,31.47) v2(84.25,27.56) v2(84.58,4.94) v2(84.58,3.2) v2(84.58,1.29) v2(85.22,17.68) v2(86.23,36.47) v2(88.26,50.19) v2(88.26,47.39) v2(88.26,44.47) v2(88.26,40.92) v2(88.65,33.93) v2(89.41,6.37) v2(91.19,33.93) v2(92.07,26.44) v2(92.07,21.23) v2(92.07,18.69) v2(92.07,14.25) v2(92.07,10.84) v2(92.07,9.42) v2(92.2,29.11) v2(92.33,16.15) v2(92.58,47.78) v2(95.12,56.67) v2(95.12,47.78) v2(95.45,37.74) v2(95.45,35.71) v2(97.27,37.74) v2(97.28,35.71) v2(97.54,56.67) v2(97.54,47.78) v2(98.93,62.38) v2(98.93,60.22) v2(98.93,58.06) v2(98.93,13.36) v2(98.93,11.62) v2(98.93,9.8) v2(99.01,37.74) v2(99.01,35.71) v3(57.78,21.38)
VCC3V3: length 156
  Top Layer w0.203: v2(40.78,31.42) 40.78,32.04 41.28,32.54 41.73,32.54 ; U20.2 41.35,14.98 ; 41.35,14.98 41.35,13.92 41.77,13.5 U20.13 ; 41.35,14.98 41.33,15.01 40.51,15.01 40.35,15.17 U20.4 40.35,16.96 39.89,17.42 v2(38.48,17.42) ; 64.74,37.68 64.74,37.7 64.75,37.7 ; 64.74,37.68 64.18,37.12 63.12,36.06 63.12,33.17 63.76,32.53 63.82,32.53 ; 64.74,37.68 64.75,37.7 ; v2(55.88,19.07) 55.86,19.09 55.86,23.64 ; TF1.4 85.74,24.25 v2(85.72,24.26) ; 69.45,38.58 69.45,38.68 ; 69.45,38.58 69.45,38.38 65.43,38.38 64.75,37.7 ; 69.45,38.58 C44.1 70.3,38.57 v2(70.87,38) ; v2(22.86,19.45) 16.26,19.45 15.75,19.96 15.75,25.95 ; STM32F446RET6.32 59.58,41.79 v2(59.18,42.19) ; U21.6 51.87,16.73 52.12,16.49 52.12,15.43 ; v2(23.75,28.84) 21.97,28.84 21.97,31.52 BUZZER1.1 ; STM32F446RET6.1 58.88,28.98 v2(58.17,28.98) 57.45,28.98 STM32F446RET6.64 ; U9.5 83.59,54.28 v2(83.57,54.25) ; v2(90.55,56.79) 90.65,56.79 95.13,61.27 ; U11.5 v2(22.76,13.61) ; 41.38,57.63 v2(42.29,57.63) ; D7.1 v2(25.27,26.66) ; U9.8 v2(88.9,54.28) ; 44.13,33.54 45.46,33.54 v2(45.47,33.55) ; STM32F446RET6.48 52.45,35.41 v2(52.45,35.33) ; U21.8 52.12,15.43 ; 52.12,15.43 52.12,15.09 52.96,14.25 C39.1 C40.1 54.16,11.2 v2(51.56,11.2) 51.56,13.34 51.42,13.48 ; 39.79,22.25 v2(38.48,22.25)
  Top Layer w0.584: C15.2 C14.2 26.42,49.55 28.24,47.73 U6.4
  Top Layer w0.6: U6.2 U6.4
  Top Layer w0.635: 3V3×3.1 3V3×3.2 3V3×3.3
  Bottom Layer w0.203: 50.36,35.38 50.42,35.33 50.56,35.33 ; R31.2 82.67,9.67 84.33,11.33 v2(86.11,11.33) R32.2 ; v2(57.28,42.19) 58.22,43.13 58.24,43.13 v2(59.18,42.19) ; 83.95,24.26 v2(85.72,24.26) ; v2(91.19,32.03) 94.74,32.03 95.55,31.22 95.55,17.76 ; v2(52.45,35.33) 50.56,35.33 ; 50.56,35.33 v2(51.31,34.58) ; R4.2 v2(85.09,16.28) ; v2(58.17,28.98) 58.17,27.07 58.11,27.02 59.06,26.08 v2(59.06,26.06) ; 78.72,67.08 v2(78.72,57.3) ; v2(45.47,33.55) 46.16,32.85 C34.1 46.86,34.06 v2(46.55,34.38) ; v2(40.78,31.42) 40.51,31.15 39.37,31.15 v2(39.37,29.87)
  vias: v2(30.82,51.33) v2(30.82,50.69) v2(30.82,50.06) v2(31.45,51.33) v2(31.45,50.69) v2(31.45,50.06)
VCC24V: length 7.3
  Top Layer w0.6: U7.7 4.11,57.21 3.56,56.67 3.56,51.86 3.54,51.84
(no net):
  vias: v1(4,66) v1(4,4) v1(96,66) v1(96,4)
ACCEL_CS: length 30
  Top Layer w0.203: 41.73,34.04 v2(40.89,34.04) ; v2(55.88,32.28) 59.82,36.22 62.57,36.22 63.82,37.47
  Bottom Layer w0.203: v2(40.89,34.04) 40.89,32.28 43.69,29.49 53.09,29.49 v2(55.88,32.28)
ACCEL_INT: length 29.1
  Top Layer w0.203: v2(61.65,33.48) 61.65,33.4 62.34,32.7 62.34,32.59 STM32F446RET6.11 ; U19.16 v2(42.93,35.84)
  SIG w0.203: v2(42.93,35.84) 42.93,31.65 45.72,28.85 53.72,28.85 58.35,33.48 v2(61.65,33.48)
ADC_IN1: length 47.3
  Top Layer w0.203: STM32F446RET6.27 62.7,41.3 v2(63.37,41.3) ; v2(81.04,24.03) 74.18,17.17 ADC/IO.1
  Bottom Layer w0.203: v2(81.04,24.03) 80.77,24.3 80.77,40.79 80.26,41.3 v2(63.37,41.3)
ADC_IN2: length 31.8
  Top Layer w0.203: ADC/IO.2 71.41,17.17 75.49,21.25 v2(75.55,21.25) ; v2(64.39,30.88) 63.96,30.46 63.04,30.46 62.41,31.09 62.41,31.11
  Bottom Layer w0.203: v2(75.55,21.25) 75.56,21.27 75.56,30.76 72.52,33.81 67.18,33.81 64.39,31.01 v2(64.39,30.88)
ADC_IN3: length 32.2
  Top Layer w0.203: v2(63.75,29.61) 63.37,30 62.87,30 62.1,30.76 STM32F446RET6.8 ; v2(75.01,23.58) 68.59,17.17 ADC/IO.3
  Bottom Layer w0.203: v2(75.01,23.58) 74.99,23.58 74.99,30.44 72.14,33.3 67.44,33.3 64.95,30.81 64.95,30.65 64.62,30.33 64.47,30.33 v2(63.75,29.61)
BMI088_MISO: length 21.2
  Top Layer w0.203: 53.92,31.11 50.01,27.2 43.31,27.2 42.38,28.13 42.38,32.05 ; 42.38,32.05 42.37,32.04 41.73,32.04 ; 42.38,32.05 42.38,34.34 42.18,34.54 41.73,34.54
BMI088_MOSI: length 18.2
  Top Layer w0.203: STM32F446RET6.57 50.21,26.69 43.18,26.69 41.78,28.09 41.78,31.48 41.73,31.54
BMI088_SCK: length 28.1
  Top Layer w0.203: v2(56.12,33.37) 59.6,36.85 62.49,36.85 63.47,37.83 ; U19.8 42.93,29.3 v2(43.2,29.03)
  Bottom Layer w0.203: v2(43.2,29.03) 43.5,28.72 53.59,28.72 56.64,31.77 56.64,32.85 v2(56.12,33.37)
BOOT0: length 29
  Top Layer w0.203: v2(51.94,25.04) 51.94,26.3 STM32F446RET6.60 ; v2(63.07,14.07) 63.1,14.1 64.77,14.1
  Bottom Layer w0.203: v2(51.94,25.04) 51.94,18.56 52.32,18.18 58.55,18.18 59.56,17.17 59.56,14.5 59.94,14.12 63.14,14.12 63.09,14.07 v2(63.07,14.07)
BUTTON1: length 68.4
  Top Layer w0.203: v2(77.14,8.02) BUT1.1 BUT1.2 83.14,15.56 v2(82.17,16.53) ; v2(58.29,37.23) 58.29,38.06 STM32F446RET6.36
  Bottom Layer w0.203: v2(77.14,8.02) 77.33,8.21 81.61,8.21 R31.1 ; v2(58.29,37.23) 60.45,35.08 73.79,35.08 77.22,31.65 77.22,21.49 v2(82.17,16.53)
BUTTON2: length 70.9
  Top Layer w0.203: v2(59.31,37.69) 59.31,37.74 58.93,38.12 58.93,38.13 STM32F446RET6.35 ; v2(83.95,16.38) 83.95,7.13 BUT2.1 BUT2.2 92.03,7.49 v2(92,7.52)
  Bottom Layer w0.203: v2(59.31,37.69) 61.04,35.96 74.17,35.96 78.1,32.03 78.1,22.25 83.95,16.41 v2(83.95,16.38) ; R32.1 91.18,8.16 91.3,8.29 92,7.59 v2(92,7.52)
BUZZER: length 26.5
  Top Layer w0.203: 34.93,28.96 37.47,31.5 37.47,36.98 37.85,37.36 42.8,37.36 45.99,34.17 45.99,34.15 46.32,33.82 46.34,33.82 48.39,31.77 50.34,31.77 STM32F446RET6.50
CAN1_H: length 95.8
  Top Layer w0.203: v2(18.06,8.53) 18.06,8.53 CN7.2 ; CAN1.2 v2(9.28,8.53) ; v2(35.6,8.53) 35.62,8.51 CN9.2 ; v2(61.94,8.53) 61.97,8.5 CN12.2 ; 53.19,5.43 53.22,5.46 v2(53.22,8.53) ; U14.2 27.96,11.83 24.75,11.83 ; CN10.2 44.41,8.52 v2(44.42,8.53) ; v2(70.74,8.53) 70.74,5.44 CN13.2 ; 24.75,11.83 24.77,11.82 v2(24.77,8.53) ; 24.75,11.83 24.06,12.53 U11.7 ; v2(26.82,8.53) 26.84,8.51 CN8.2
  SIG w0.203: v2(70.74,8.53) v2(61.94,8.53) v2(53.22,8.53) v2(44.42,8.53) v2(35.6,8.53) v2(26.82,8.53) v2(24.77,8.53) v2(18.06,8.53) v2(9.28,8.53)
CAN1_L: length 90.2
  Top Layer w0.203: CN9.1 v2(36.87,6.63) ; CN13.1 72.01,5.44 v2(72.01,6.63) ; CN12.1 63.25,5.46 v2(63.25,6.63) ; 28.09,5.43 v2(28.09,6.63) ; v2(22.71,7.77) 22.73,7.77 22.75,7.79 22.75,11.83 ; v2(54.48,6.63) 54.48,5.48 CN11.1 ; v2(10.54,6.63) 10.54,5.44 CAN1.1 ; U11.6 23.41,12.51 22.75,11.85 22.75,11.83 ; CN7.1 v2(19.31,6.63) ; U15.2 22.65,11.94 22.75,11.83 ; CN10.1 v2(45.66,6.63)
  SIG w0.203: v2(72.01,6.63) 72.01,7.39 71.63,7.77 63.28,7.77 ; 28.06,7.77 28.09,7.74 v2(28.09,6.63) ; 28.06,7.77 36.9,7.77 ; 28.06,7.77 v2(22.71,7.77) 19.3,7.77 ; 36.9,7.77 45.67,7.77 ; 36.9,7.77 36.87,7.74 v2(36.87,6.63) ; 54.44,7.77 63.28,7.77 ; 54.44,7.77 54.48,7.72 v2(54.48,6.63) ; 54.44,7.77 45.67,7.77 ; 63.28,7.77 63.25,7.73 v2(63.25,6.63) ; 45.67,7.77 45.66,7.76 v2(45.66,6.63) ; v2(19.31,6.63) 19.31,7.76 19.3,7.77 ; 19.3,7.77 10.8,7.77 10.54,7.52 v2(10.54,6.63)
CAN1_RX: length 42.6
  Top Layer w0.203: v2(53.36,25.46) 53.36,27.01 STM32F446RET6.61 ; U11.4 v2(22.76,18.06)
  SIG w0.203: v2(53.36,25.46) 53.36,19.86 52.96,19.45 24.15,19.45 v2(22.76,18.06)
CAN1_TX: length 40.9
  Top Layer w0.203: STM32F446RET6.62 54.37,27.31 v2(54.37,25.92) ; U11.1 v2(24.71,18.06)
  SIG w0.203: v2(24.71,18.06) 25.6,18.95 53.21,18.95 53.97,19.71 53.97,25.52 v2(54.37,25.92)
CAN2_H: length 37.7
  Top Layer w0.203: U16.2 39.25,59.96 39.39,60.09 ; 39.39,60.09 40.08,59.4 40.08,57.63 ; 39.39,60.09 39.39,63.52 ; CN17.2 53.34,64.83 v2(53.34,63.52) ; CN15.2 37.97,64.79 v2(37.97,63.52) ; v2(30.24,63.52) 30.22,63.54 CAN2.2 ; 45.62,64.84 45.59,64.81 v2(45.59,63.52)
  SIG w0.203: v2(30.24,63.52) v2(37.97,63.52) v2(39.39,63.52) v2(45.59,63.52) v2(53.34,63.52)
CAN2_L: length 41.2
  Top Layer w0.203: CN17.1 52.1,64.83 v2(52.1,62.61) ; CAN2.1 28.97,62.4 v2(28.99,62.38) ; U17.2 44.57,60.09 41.39,60.09 ; U12.6 40.73,59.44 41.39,60.09 ; 36.67,64.84 36.73,64.78 v2(36.73,62.38) ; v2(41.55,62.38) 41.55,60.26 41.39,60.09 ; v2(44.36,62.63) 44.36,64.62 44.59,64.84
  SIG w0.203: 28.99,62.38 v2(36.73,62.38) 41.55,62.38 ; v2(41.55,62.38) 41.8,62.63 v2(44.36,62.63) 52.07,62.63 v2(52.1,62.61)
CAN2_RX: length 21.3
  Top Layer w0.203: v2(41.91,54.25) 41.89,54.25 41.38,54.77 ; v2(56.13,43.2) 56.13,42.34 STM32F446RET6.33
  SIG w0.203: v2(56.13,43.2) 52.96,43.2 v2(41.91,54.25)
CAN2_TX: length 23.3
  Top Layer w0.203: v2(55.08,42.6) 55.16,42.6 STM32F446RET6.34 ; U12.1 39.43,53.56 39.75,53.24 v2(39.75,53.11)
  SIG w0.203: v2(55.08,42.6) 52.8,42.6 42.29,53.11 v2(39.75,53.11)
GYRO_CS: length 21.3
  Top Layer w0.203: 44.13,32.54 44.13,32.53 v2(45.21,32.53) ; v2(61.34,37.74) 61.34,37.87 62.36,38.89 62.41,38.89
  SIG w0.203: v2(45.21,32.53) 50.91,32.53 54.34,35.96 60.07,35.96 61.34,37.23 v2(61.34,37.74)
GYRO_INT: length 32.6
  Top Layer w0.203: 41.73,33.04 v2(38.11,33.04) ; STM32F446RET6.10 62.71,31.46 v2(61.69,32.49)
  SIG w0.203: v2(61.69,32.49) 61.26,32.92 58.55,32.92 54.1,28.47 42.68,28.47 v2(38.11,33.04)
IMU_SCL: length 28.7
  Top Layer w0.203: 53.86,23.64 v2(51.31,23.64) ; STM32F446RET6.58 49.69,25.47 v2(49.69,23.72) U21.4 44.03,17.38 43.74,17.09 43.74,15.72 43.54,15.52 41.86,15.52 U20.1
  SIG w0.203: v2(51.31,23.64) 49.73,23.64 49.69,23.68 v2(49.69,23.72)
IMU_SDA: length 27.9
  Top Layer w0.203: 53.86,20.47 50.43,20.47 50.42,20.46 ; 50.42,20.46 50.42,17.04 50.11,16.73 U21.3 44.65,16.73 44.32,16.41 44.32,15.29 44.04,15.01 42.38,15.01 U20.16 ; 50.42,20.46 50.42,25.49 STM32F446RET6.59
LED1: length 20.5
  Top Layer w0.203: 46.97,22.25 46.99,22.26 v2(46.99,23.64) ; STM32F446RET6.2 58.55,30.02 v2(58.55,32.03)
  Bottom Layer w0.203: v2(58.55,32.03) 52.45,25.93 49.02,25.93 46.99,23.9 v2(46.99,23.64)
NRST: length 60
  Top Layer w0.203: v2(60.83,31.9) 60.83,31.27 STM32F446RET6.7 ; RESET.1 96.15,7.39 v2(94.36,7.39)
  Bottom Layer w0.203: v2(60.83,31.9) 64.26,31.9 66.68,34.31 73.03,34.31 76.33,31.01 76.33,17.3 80.76,12.87 93.07,12.87 94.36,11.58 v2(94.36,7.39)
OLED_SCL: length 25.1
  Top Layer w0.203: v2(56.13,50.7) 62.87,50.7 63.88,49.68 63.88,43.9 STM32F446RET6.29
  SIG w0.203: v2(56.13,50.7) OLED.3
OLED_SDA: length 30.2
  Top Layer w0.203: 52.86,32.17 53.97,33.28 53.97,33.3 54.12,33.44 54.35,33.44 v2(54.4,33.49)
  Bottom Layer w0.203: v2(54.4,33.49) 54.54,33.49 55.5,34.44 55.5,34.82 50.04,40.28 50.04,47.27 53.59,50.82 OLED.4
OSC32IN: length 13.1
  Top Layer w0.254: STM32F446RET6.3 60.29,29.02 59.02,30.28 v2(59.13,30.4)
  Bottom Layer w0.254: v2(59.13,30.4) 59.13,30.26 61.11,28.28 61.11,24.46 59.8,23.15 60.07,22.89 X2.1
OSC32OUT: length 13.3
  Top Layer w0.254: STM32F446RET6.4 59.82,30.17 v2(59.82,30.82)
  Bottom Layer w0.254: v2(59.82,30.82) 59.82,30.15 61.57,28.4 61.57,24.46 62.88,23.15 62.62,22.89 X2.2
OSC_IN: length 13.7
  Top Layer w0.203: 67.3,25.87 68.56,27.14 70.65,27.14 X1.1
  Top Layer w0.254: 67.3,25.87 67.3,26.9 67.12,27.08 63.67,27.08 61.77,28.99 61.71,28.99 STM32F446RET6.5
OSC_OUT: length 13.7
  Top Layer w0.203: X1.3 69.05,27.58 68.41,27.58 67.3,28.7
  Top Layer w0.254: 67.3,28.7 67.3,27.67 67.12,27.49 65.86,27.49 65.68,27.67 65.68,28.62 65.5,28.8 65.25,28.8 65.07,28.62 65.07,27.67 64.89,27.49 63.84,27.49 62.06,29.27 62.06,29.34 STM32F446RET6.6
SDIO_CK: length 52
  Top Layer w0.203: STM32F446RET6.28 65.67,44.98 80.65,44.98 82.17,43.46 82.17,36.37 82.22,36.32 82.22,35.86 82.17,35.81 82.17,24.66 83.68,23.15 TF1.5 87.72,23.14 v2(89.15,23.14)
  Bottom Layer w0.203: D19.2 90.09,22.2 v2(89.15,23.14)
SDIO_CMD: length 50.1
  Top Layer w0.203: v2(85.22,25.93) 85.8,25.35 TF1.3 87.73,25.32 v2(89.28,25.32) ; STM32F446RET6.54 53.93,32.53 54.36,32.53 v2(54.48,32.66)
  SIG w0.203: v2(54.48,32.66) 55.88,34.06 84.89,34.06 85.22,33.73 v2(85.22,25.93)
  Bottom Layer w0.203: 93.55,23.86 91.51,23.86 D13.2 89.89,24.82 89.38,25.32 v2(89.28,25.32)
SDIO_D0: length 58.1
  Top Layer w0.203: v2(89.15,20.98) 87.74,20.98 TF1.7 82.07,20.95 v2(82.04,20.98) ; v2(56.04,38.63) 55.6,38.63 STM32F446RET6.39
  Bottom Layer w0.203: v2(89.15,20.98) 89.47,20.66 89.47,20.02 89.91,19.59 D15.2 92.33,19.59 93.55,20.81 ; v2(82.04,20.98) 80.01,23.01 80.01,38.76 79.25,39.52 56.93,39.52 v2(56.04,38.63)
SDIO_D1: length 59.8
  Top Layer w0.203: v2(82.04,19.85) TF1.8 87.72,19.83 v2(88.9,19.83) ; STM32F446RET6.40 55.32,38.2 v2(55.32,37.97)
  Bottom Layer w0.203: 93.55,17.76 93.47,17.68 91.95,17.68 91.24,16.97 D14.2 89.61,16.97 89.28,17.3 89.28,19.45 v2(88.9,19.83) ; v2(55.32,37.97) 55.42,37.87 56.51,37.87 57.29,38.65 78.47,38.65 79.12,38 79.12,22.77 v2(82.04,19.85)
SDIO_D2: length 51.5
  Top Layer w0.203: 52.16,32.88 53.27,34 v2(53.27,34.1) ; v2(89.15,27.58) 87.74,27.58 TF1.1 87.28,27.55 v2(86.61,28.22)
  SIG w0.203: v2(86.61,28.22) 86.61,34.95 86.11,35.46 54.63,35.46 v2(53.27,34.1)
  Bottom Layer w0.203: 93.55,29.95 93.45,30.05 D18.2 89.41,28.91 89.41,27.84 v2(89.15,27.58)
SDIO_D3: length 50.4
  Top Layer w0.203: 52.51,32.53 54.3,34.31 v2(54.36,34.31) ; v2(85.98,26.82) 86.35,26.45 TF1.2 87.72,26.44 v2(89.28,26.44)
  SIG w0.203: v2(54.36,34.31) 54.74,34.69 85.65,34.69 85.98,34.36 v2(85.98,26.82)
  Bottom Layer w0.203: v2(89.28,26.44) 90.28,27.44 D17.2 93.02,27.44 93.55,26.9
SERVO1: length 73.1
  Top Layer w0.203: v2(52.07,39.52) 52.07,39.33 STM32F446RET6.43
  SIG w0.203: SERV1.3 9.4,11.58 9.4,21.23 14.99,26.82 14.99,39.27 15.88,40.16 51.44,40.16 v2(52.07,39.52)
SERVO2: length 70.7
  Top Layer w0.203: STM32F446RET6.42 53.57,38.67 52.71,39.54 52.71,39.9 52.39,40.22 52.39,40.34 v2(52.4,40.36)
  SIG w0.203: SERV2.3 8.25,14.5 8.25,21.11 14.22,27.07 14.22,39.39 15.75,40.92 51.85,40.92 v2(52.4,40.36)
SERVO3: length 68.3
  Top Layer w0.203: v2(53.09,40.92) 53.09,39.73 53.92,38.89
  SIG w0.203: SERV3.3 6.86,20.72 13.59,27.45 13.59,39.77 15.37,41.55 52.45,41.55 v2(53.09,40.92)
SWCLK: length 52.2
  Top Layer w0.203: STM32F446RET6.49 50.78,32.92 48.93,32.92 v2(48.72,33.12) ; SWDIO/CLK.3 64.52,64.7 v2(64.52,62.89)
  SIG w0.203: v2(46.23,35.58) 46.26,35.58 v2(48.72,33.12)
  Bottom Layer w0.203: v2(64.52,62.89) 60.58,58.95 50.16,58.95 42.93,51.71 42.93,38.89 v2(46.23,35.58)
SWDIO: length 52.2
  Top Layer w0.203: SWDIO/CLK.2 v2(63.25,62.89) ; v2(47.5,37.74) 47.62,37.74 48.26,38.38 50.9,38.38 52.16,37.12
  SIG w0.203: v2(47.5,37.74) 46.69,38.56 v2(42.22,38.56)
  Bottom Layer w0.203: v2(63.25,62.89) 63.25,62.25 60.45,59.46 49.78,59.46 42.29,51.97 42.29,38.61 42.24,38.56 v2(42.22,38.56)
TIM3_CH1: length 26.9
  Top Layer w0.203: v2(81.41,45.74) 81.41,51.2 ; STM32F446RET6.22 63.95,39.01 65.02,39.01 v2(69.09,43.08)
  SIG w0.203: v2(69.09,43.08) 71.75,45.74 v2(81.41,45.74)
TIM3_CH2: length 24.3
  Top Layer w0.203: v2(67.56,43.08) 67.3,43.08 STM32F446RET6.23 ; v2(78.87,46.5) H9.2
  SIG w0.203: v2(67.56,43.08) 68.78,44.3 68.78,44.58 69.11,44.91 69.39,44.91 70.99,46.5 v2(78.87,46.5)
TIM3_CH3: length 21.7
  Top Layer w0.203: v2(63.75,40.54) 62.64,40.54 STM32F446RET6.26 ; v2(76.33,47.27) H9.3
  SIG w0.203: v2(63.75,40.54) 70.49,47.27 v2(76.33,47.27)
TTL_DM: length 7.7
  Top Layer w0.152: v3(88.67,64.79) 88.67,63.73 USART2.B7 ; USART2.A7 87.65,63.72 v3(87.65,64.77)
  Top Layer w0.203: USART2.A7 87.63,62.51 87.5,62.38 87,62.38 86.87,62.25 U9.2
  SIG w0.152: v3(88.67,64.79) 88.64,64.77 v3(87.65,64.77)
TTL_DP: length 7.8
  Top Layer w0.152: USART2.B6 87.13,65.14 87.25,65.25 88.01,65.25 88.13,65.12 USART2.A6
  Top Layer w0.203: USART2.A6 88.14,63.69 U9.1
UART4_RX: length 39.3
  Top Layer w0.203: v2(92.11,42.03) 92.14,42.06 94.57,42.06 94.59,42.08 ; STM32F446RET6.15 65.23,32.53 76.33,32.53 76.84,33.04 76.84,41.42 v2(77.53,42.12)
  Bottom Layer w0.203: v2(92.11,42.03) 92.01,42.12 v2(77.53,42.12)
UART4_TX: length 40.7
  Top Layer w0.203: 94.59,43.33 94.55,43.37 v2(92.07,43.37) ; 64.18,32.88 65.16,31.9 76.96,31.9 77.85,32.79 77.85,41.04 80,43.19 80,43.27 v2(79.89,43.37)
  Bottom Layer w0.203: v2(79.89,43.37) v2(92.07,43.37)
USART2_RX: length 37.1
  Top Layer w0.203: STM32F446RET6.17 65.7,37.23 v2(66.8,37.23) ; U9.6 v2(85.6,52.73)
  SIG w0.203: v2(85.6,52.73) 85.6,38.89 84.07,37.36 66.93,37.36 v2(66.8,37.23)
USART2_TX: length 39.8
  Top Layer w0.203: v2(67.56,36.6) 67.56,36.27 STM32F446RET6.16 ; U9.7 v2(86.87,52.73)
  SIG w0.203: v2(86.87,52.73) 86.87,38.76 84.84,36.73 67.69,36.73 v2(67.56,36.6)
USART3_RX: length 63.5
  Top Layer w0.203: Q1.3 12.95,26.82 14.1,27.96 15.73,27.96 15.75,27.95 v2(17.53,27.95) ; v2(60.45,37.49) 60.45,38 60.71,38.25 61.06,38.25 61.11,38.3 61.11,38.3 STM32F446RET6.25
  SIG w0.203: v2(60.45,37.49) 59.56,36.6 50.16,36.6 49.71,37.06 49.68,37.06 49.35,37.38 49.35,37.41 47.24,39.52 18.54,39.52 17.53,38.5 v2(17.53,27.95)
USART6_RX: length 53
  Top Layer w0.203: v2(83.95,48.28) 90.17,48.28 92.86,50.97 94.59,50.97 ; v2(53.8,41.35) 53.8,41.14 STM32F446RET6.38
  Bottom Layer w0.203: v2(53.8,41.35) 50.93,44.22 50.93,45.23 53.97,48.28 v2(83.95,48.28)
USART6_TX: length 47.6
  Top Layer w0.203: STM32F446RET6.37 56.9,38.75 v2(56.9,37.23) ; 94.59,52.22 92.46,52.22 89.53,49.3 v2(83.95,49.3)
  SIG w0.203: v2(83.95,49.3) 69.34,49.3 57.28,37.23 v2(56.9,37.23)
USB_DM: length 63.1
  Top Layer w0.152: v3(77.72,64.79) 77.72,63.71 USB.B7 ; USB.A7 76.71,63.7 v3(76.71,64.79)
  Top Layer w0.254: USB.A7 76.71,62.87 76.66,62.82 76.66,61.69 76.84,61.51 77.42,61.51 77.6,61.33 77.6,61.08 77.42,60.9 76.84,60.9 76.66,60.72 76.66,60.47 76.84,60.29 77.42,60.29 77.6,60.11 77.6,59.86 77.42,59.68 76.84,59.68 76.66,59.5 76.66,56.81 73.07,53.21 48.01,53.21 44.98,50.19 44.98,45.64 52.09,38.54 52.15,38.54 52.86,37.83
  SIG w0.152: v3(76.71,64.79) v3(77.72,64.79)
USB_DP: length 63.2
  Top Layer w0.152: USB.B6 76.21,65.19 76.33,65.3 76.74,65.3 ; 76.74,65.3 76.74,65.92 v2(76.72,65.94) ; 76.74,65.3 77.09,65.3 77.22,65.17 77.22,63.7 USB.A6
  Top Layer w0.254: USB.B6 76.21,62.87 76.26,62.82 76.26,56.98 72.9,53.62 47.84,53.62 44.58,50.36 44.58,45.47 51.8,38.25 51.8,38.19 52.51,37.47
  Bottom Layer w0.152: 76.72,67.08 v2(76.72,65.94)
WS2812: length 19.6
  Top Layer w0.203: v2(49.48,33.78) 40.49,42.77 LED2.4 ; v2(51.66,30.4) 51.69,30.38 52.48,30.38 STM32F446RET6.55
  Bottom Layer w0.203: v2(49.48,33.78) 49.5,33.78 49.53,33.75 49.53,32.53 v2(51.66,30.4)
$1N6813: length 7.9
  Top Layer w0.203: 64.77,12.1 66.18,10.69 69.34,10.69 71.12,12.47 BOOT0
.2
$1N10170: length 4.2
  Top Layer w0.6: U7.1 11.16,53.72 10.67,53.24 9.38,53.24
$1N10572: length 18.9
  Top Layer w0.6: L1.1 14.64,57.54 D1.2 7.75,51.46 7.38,51.82 7.38,53.24 6.35,53.24 5.76,53.83 U7.8
$1N10581: length 14.5
  Top Layer w0.6: 15.73,62.51 C26.2 21.02,57.66 L1.2
  Top Layer w1.016: C25.1 L1.2
$1N11994: length 5.2
  Top Layer w0.203: STM32F446RET6.30 62.23,42.95 62.23,45.38
$1N17339: length 2.8
  Top Layer w0.508: U18.4 4.95,46.12 4.32,45.49 3.54,45.49
$1N17600: length 2.7
  Top Layer w0.203: DT7/USART3RX.1 6.86,25.69 6.98,25.82
$1N17601: length 3.2
  Top Layer w0.203: 6.98,27.82 10.14,27.82 Q1.1
$1N17854: length 5.7
  Top Layer w0.203: 29.25,28.95 29.25,28.43 29.72,27.96 30.01,27.96 ; 29.25,28.95 BUZZER1.2 ; 29.25,28.95 29.2,29.01 D7.2
$1N17986: length 2.5
  Top Layer w0.203: 34.93,26.96 34.88,27.01 Q2.1
$1N19919: length 3.2
  Top Layer w0.203: 97.13,61.27 97.05,61.19 97.05,58.43 3V3.2
$1N19978: length 5.2
  Top Layer w0.254: 15.82,65.78 15.87,65.83 21.02,65.83
$1N20666: length 2.7
  Top Layer w0.203: 41.85,10.31 41.85,10.32 U20.12
$1N20667: length 3.2
  Top Layer w0.203: 39.85,10.31 39.84,10.32 39.84,13.5
$1N20697: length 4.9
  Top Layer w0.203: v2(38.05,12.09) 38.05,13.25 ; v2(40.85,12.09) 40.85,12.98 U20.10
  SIG w0.203: v2(40.85,12.09) v2(38.05,12.09)
$1N20825: length 2.7
  Top Layer w0.203: U21.5 53.82,17.38 53.86,17.42
$1N21033: length 3.7
  Top Layer w0.203: 49.42,13.48 48.75,14.15 48.75,15.94 48.9,16.08 U21.2
$1N21210: length 3
  Top Layer w0.203: 41.99,22.25 44.97,22.25

## Copper pours and planes (outline as drawn; the poured copper is in the pictures)
+5V on Top Layer: 74.26,63.76 74.86,63.76 74.86,61.67 74.26,61.67
+5V on Top Layer: 14.16,47.59 16.08,47.59 16.08,45.9 14.16,45.9
+5V on Top Layer: 10.41,63.23 14.35,63.23 14.35,59.46 10.41,59.46
+5V on Top Layer: 85.17,63.7 85.77,63.7 85.77,61.62 85.17,61.62
+5V on Top Layer: 79.06,63.7 79.66,63.7 79.66,61.61 79.06,61.61
+5V on Top Layer: 90,63.7 90.6,63.7 90.6,61.62 90,61.62
+5V on POW: 3.43,6.5 21.34,6.5 21.34,51.84 29.59,60.09 92.96,60.09 92.96,67.46 12.06,67.46 3.43,58.82
GND on Top Layer: 0,70 100.08,70 100.08,-0.1 0,-0.1
GND on Bottom Layer: 0,70 100.08,70 100.08,-0.1 0,-0.1
GND on GND1: 1.02,68.98 98.98,68.98 98.98,1.02 1.02,1.02
GND on SIG: 0,70 100.2,70 100.2,-0.1 0,-0.1
GND on POW: -0.13,70 100.2,70 100.2,-0.23 -0.13,-0.23
GND on GND2: 1.02,68.98 98.98,68.98 98.98,1.02 1.02,1.02
VCC3V3 on Top Layer: 30.12,51.65 31.82,51.65 31.82,49.73 30.12,49.73
VCC3V3 on POW: 29.34,58.44 22.1,51.2 22.1,6.63 90.42,6.63 92.07,8.28 92.07,56.67 90.42,58.32 29.71,58.44
VCC24V on Top Layer: 2.83,52.48 7.03,52.48 7.03,46.97 2.83,46.97
POWER on Top Layer: 10.41,50.31 12.39,50.31 12.39,36.6 10.41,36.6

Small or netless copper shapes (teardrops, artwork), in the pictures only: 519 on Top Layer, 153 on Bottom Layer, 78 on GND1, 98 on SIG, 78 on GND2

## Text on the board
Top Silkscreen Layer: CAN1 | CAN2 | VenusPark | 5V×3
